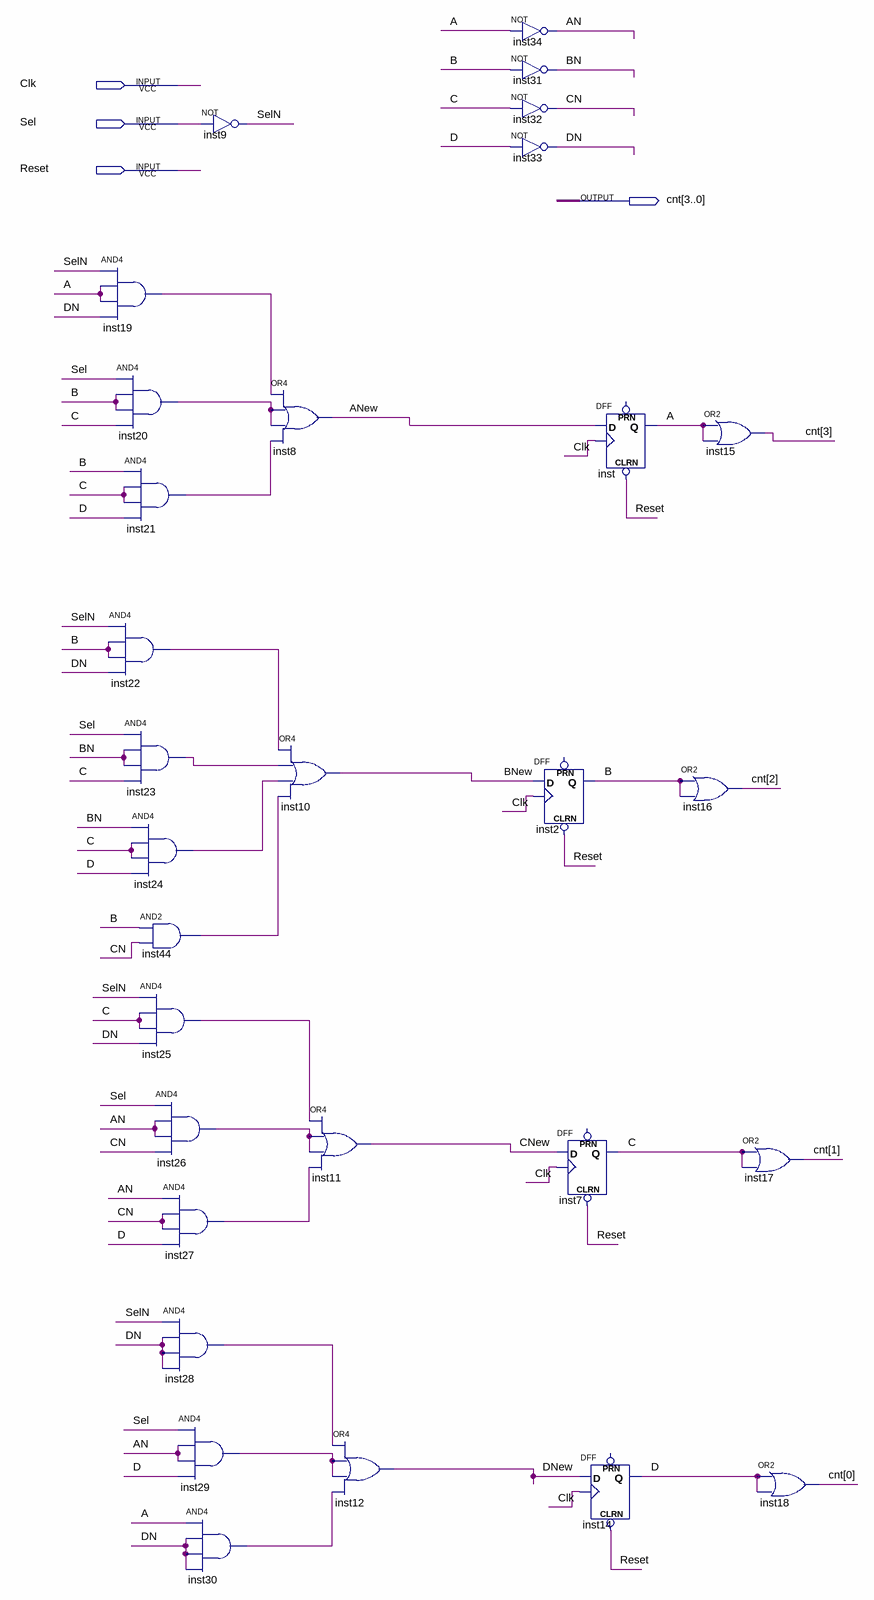
[diagram p0: schematic sheet]
// Quartus schematic cnt_4bit.bdf as structural Verilog: 30 symbols, 4 pins
module cnt_4bit (
  input  Clk,
  input  Sel,
  input  Reset,
  output [3:0] cnt
);

  wire A, AN, ANew, B, BN, BNew, C, CN, CNew, D, DN, DNew, inst19_out, inst20_out, inst21_out, inst22_out,
       inst23_out, inst24_out, inst25_out, inst26_out, inst27_out, inst28_out, inst29_out, inst30_out,
       inst44_out, SelN;

  and inst19 (inst19_out, SelN, A, A, DN);
  and inst20 (inst20_out, Sel, B, B, C);
  and inst21 (inst21_out, B, C, C, D);
  and inst22 (inst22_out, SelN, B, B, DN);
  and inst23 (inst23_out, Sel, BN, BN, C);
  and inst24 (inst24_out, BN, C, C, D);
  and inst44 (inst44_out, B, CN);
  and inst25 (inst25_out, SelN, C, C, DN);
  and inst26 (inst26_out, Sel, AN, AN, CN);
  not inst9 (SelN, Sel);
  and inst27 (inst27_out, AN, CN, CN, D);
  and inst28 (inst28_out, SelN, DN, DN, DN);
  and inst29 (inst29_out, Sel, AN, AN, D);
  and inst30 (inst30_out, A, DN, DN, DN);
  or inst8 (ANew, inst19_out, inst20_out, inst20_out, inst21_out);
  or inst10 (BNew, inst22_out, inst23_out, inst24_out, inst44_out);
  or inst11 (CNew, inst25_out, inst26_out, inst26_out, inst27_out);
  or inst12 (DNew, inst28_out, inst29_out, inst29_out, inst30_out);
  not inst34 (AN, A);
  not inst31 (BN, B);
  not inst32 (CN, C);
  not inst33 (DN, D);
  DFF inst2 (.CLRN(Reset), .CLK(Clk), .D(BNew), .Q(B));  // open: PRN
  DFF inst7 (.CLRN(Reset), .CLK(Clk), .D(CNew), .Q(C));  // open: PRN
  DFF inst14 (.CLRN(Reset), .CLK(Clk), .D(DNew), .Q(D));  // open: PRN
  DFF inst (.CLRN(Reset), .CLK(Clk), .D(ANew), .Q(A));  // open: PRN
  or inst15 (cnt[3], A, A);
  or inst16 (cnt[2], B, B);
  or inst17 (cnt[1], C, C);
  or inst18 (cnt[0], D, D);
endmodule
